# EasyEDA Pro project ESP32-C3-Devkit-M1自动灌溉拓展板.eprj

# Schematic Schematic1
Create Date: 2025-03-11; Page Name: P1; Project Name: ESP32WROOM浇花; Schematic Name: Schematic1; Update Date: 2025-03-11; Company: 嘉立创EDA; Page Size: A4; Version: V1.0
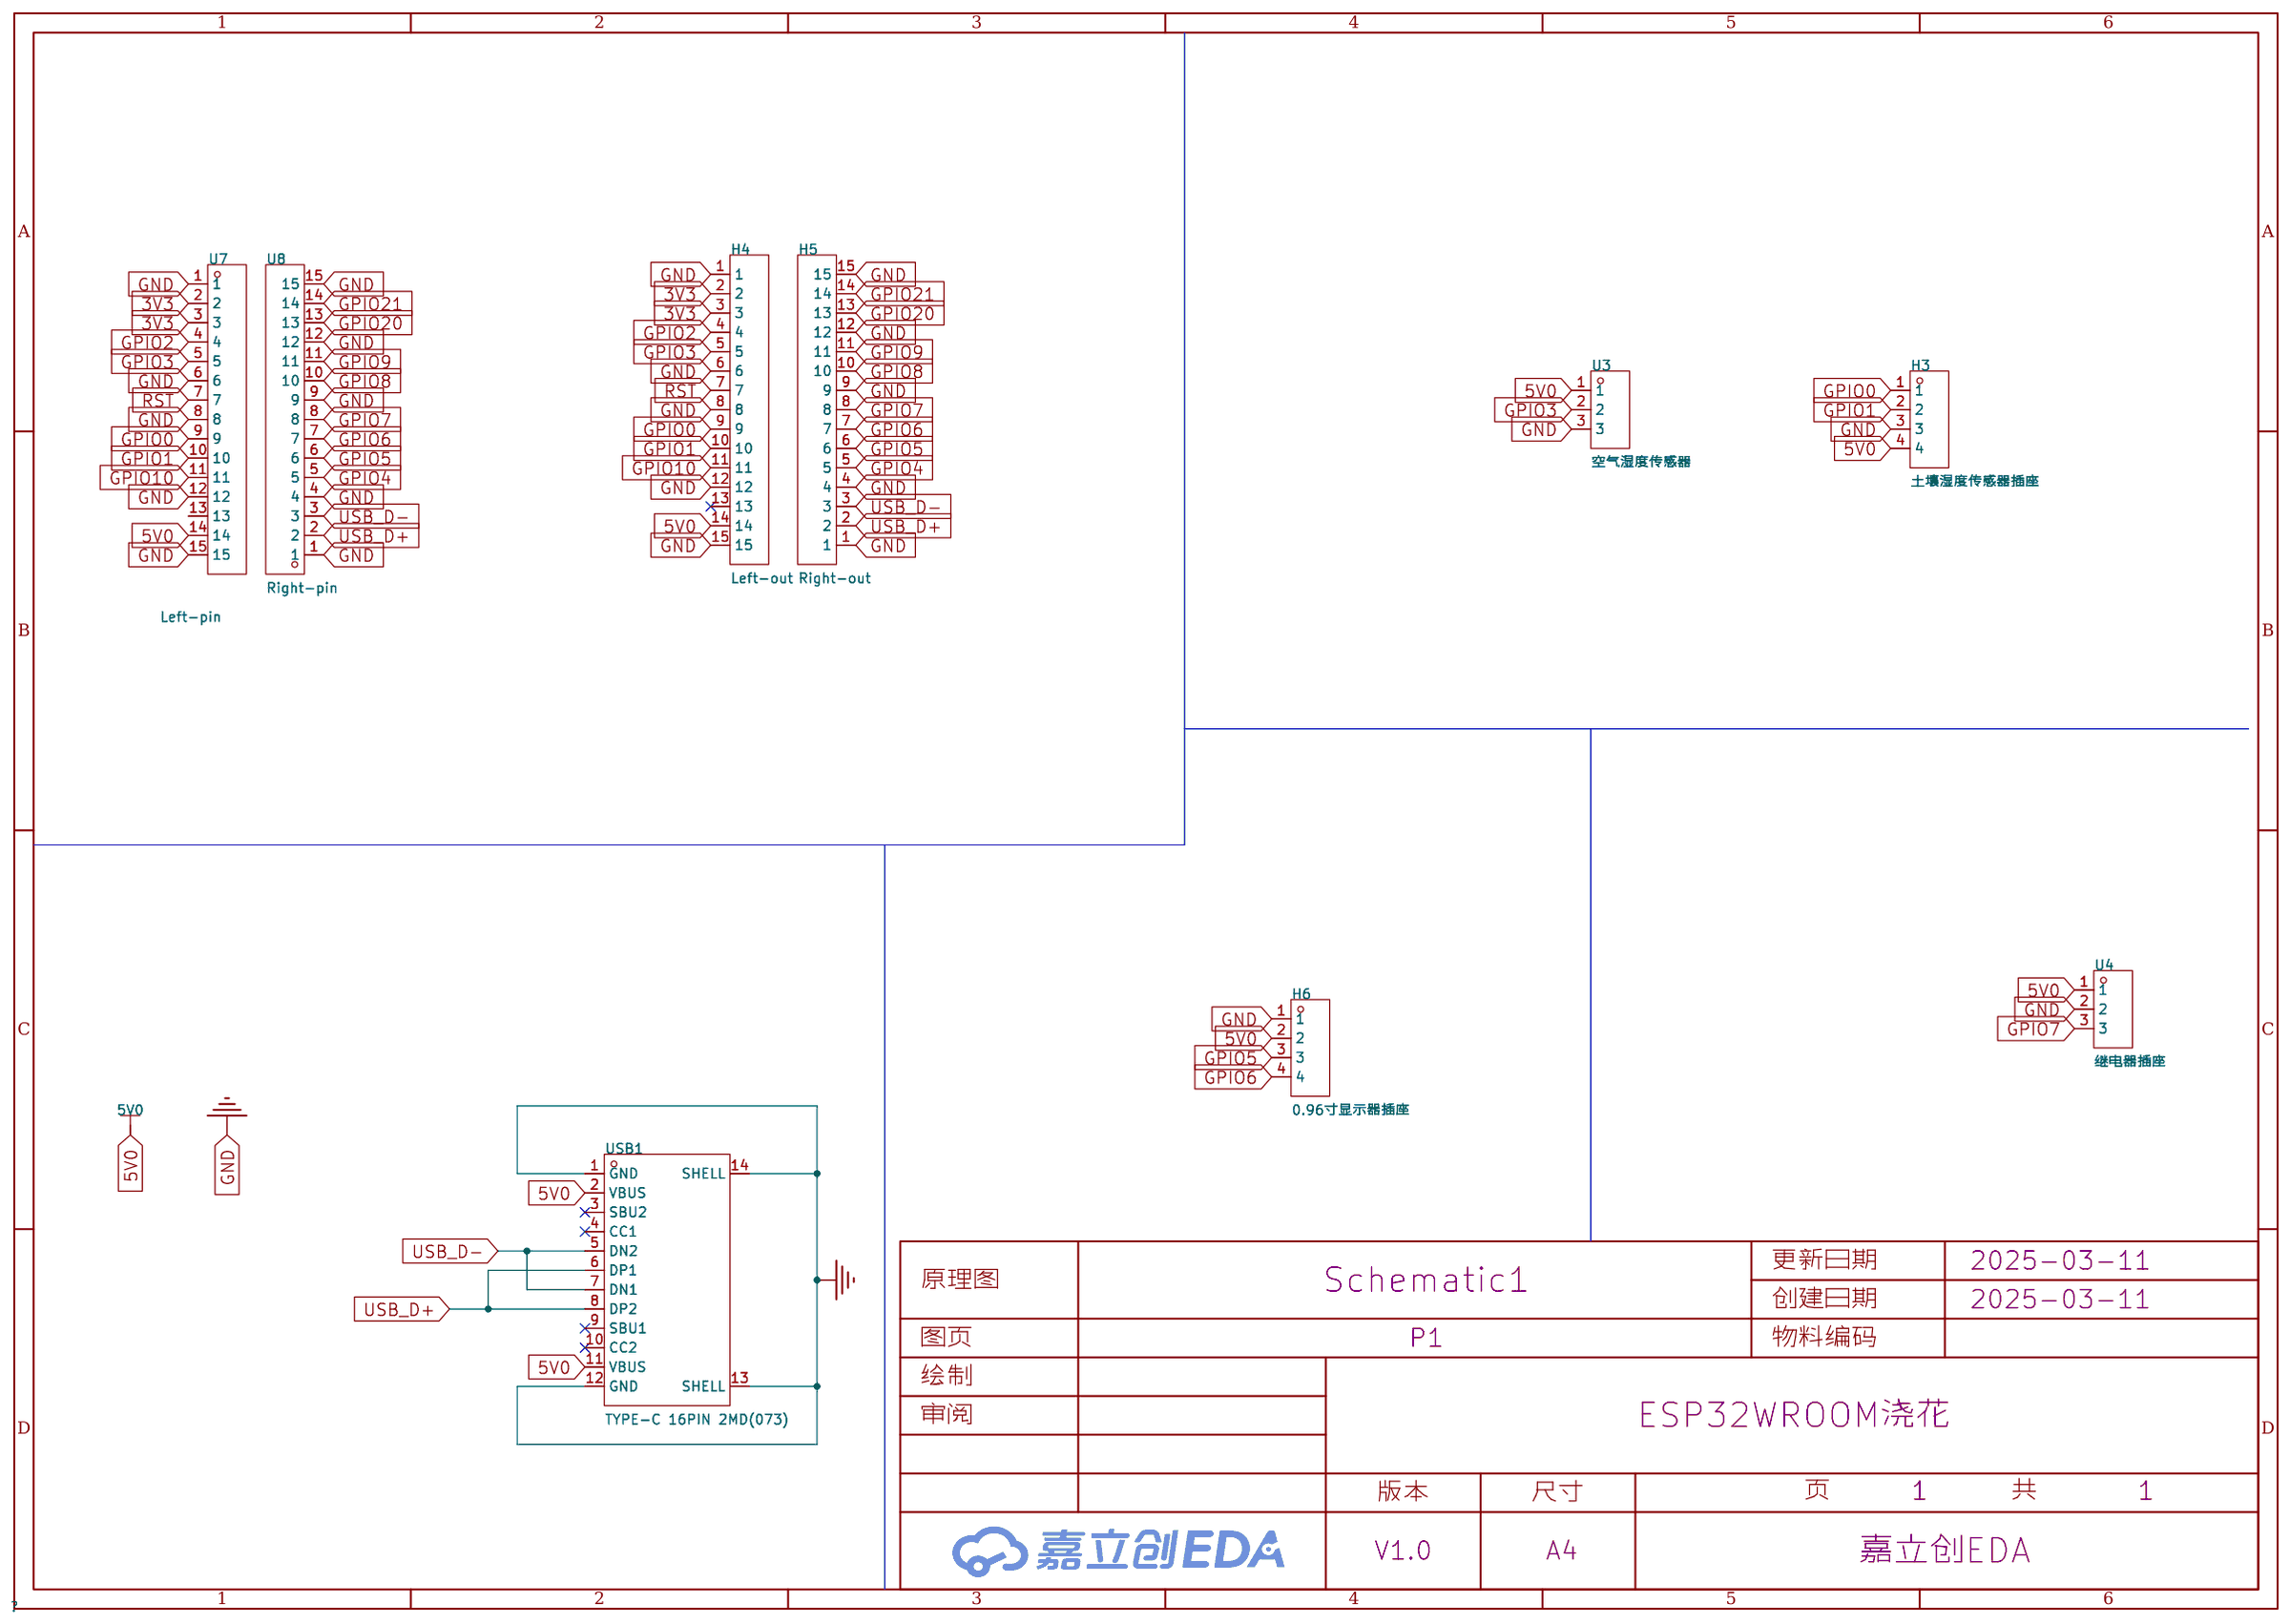
[diagram p0: schematic sheet]

## Parts
H3  土壤湿度传感器插座  [HDR-TH_4P-P2.54-V-F]
H4  Left-out  [HDR-TH_15P-P2.54-V-M]
H5  Right-out  [HDR-TH_15P-P2.54-V-M]
H6  0.96寸显示器插座  [HDR-TH_4P-P2.54-V-F]
U3  空气湿度传感器  [HDR-TH_3P-P2.54_CS-1165SDIG]
U4  继电器插座  [HDR-TH_3P-P2.54_CS-1165SDIG]
U7  Left-pin  [HDR-TH_15P-P2.54-V-F]
U8  Right-pin  [HDR-TH_15P-P2.54-V-F]
USB1  TYPE-C 16PIN 2MD(073)  [USB-C-SMD_TYPE-C-6PIN-2MD-073]

## Library data of the parts
H3 H6 = 2.54-1*4P母: 插孔结构:1x4P;间距:2.54mm;行距:-;圆孔/方孔:方孔;安装类型:直插;排数:单排;总孔位数:4P;额定电流:3A;额定电压:-;插孔方向:顶部;塑高:-;触头材质:青铜;触头镀层:-;工作温度范围:-40℃~+105℃;焊接温度(最大值):-;; LCSC Part Name: 间距:2.54mm 1x4P 直插; Supplier Part: C2718488; Manufacturer: BOOMELE(博穆精密); Supplier Footprint: 插件,P=2.54mm; JLCPCB Part Class: 扩展库; Datasheet: https://atta.szlcsc.com/upload/public/pdf/source/20210301/C2718488_F4427B881E42CAA8DDB0B1C12B3A522C.pdf; Supplier: LCSC; Holes Structure: 1x4P; Pitch: 2.54mm; Circular Hole / Square Hole: 方孔; Mounting Type: 直插; Number of Rows: 单排; Number of Holes: 4P; Current Rating (Max): 3A; Holes Direction: 顶部; Contact Material: 青铜; Operating Temperature Range: -40℃~+105℃
H4 H5 = KH-2.54PH180-1X15P-L11.5: 插针结构:1x15P;间距:2.54mm;行距:-;圆针/方针:方针;安装方式:直插;排数:单排;总PIN位数:15P;额定电流:3A;额定电压:-;配合针长度:6mm;塑高:2.5mm;端接针长度:3mm;工作温度:-40℃~+105℃;颜色:黑色;; LCSC Part Name: 1x15P 间距:2.54mm 方针 直插; Supplier Part: C2932704; Manufacturer: kinghelm(金航标); Supplier Footprint: 插件,P=2.54mm; JLCPCB Part Class: 扩展库; Datasheet: https://atta.szlcsc.com/upload/public/pdf/source/20211220/9B4C897403A4421D34166806733D6939.pdf; Supplier: LCSC; Pin Structure: 1x15P; Pitch: 2.54mm; Circluar Pins/Square Pins: 方针; Mounting Type: 直插; Number of Rows: 单排; Number of Pins: 15P; Current Rating: 3A; Length of Mating Pin: 6mm; Insulation Height: 2.5mm; Length of End Connection Pin: 3mm; Operating Temperature: -40℃~+105℃; Color: 黑色
U3 U4 = 排母2.54mm 1X3pin: Supplier Part: C9900016709; JLCPCB Part Class: 扩展库; Supplier: LCSC
U7 U8 = HC-PM254-8.5H-1x15PZ: 插孔结构:1x15P;间距:2.54mm;行距:-;圆孔/方孔:方孔;安装方式:直插;排数:单排;总孔位数:15P;额定电流:3A;额定电压:-;插孔方向:顶部;塑高:8.5mm;触头材质:黄铜;触头镀层:金;工作温度:-40℃~+105℃;; LCSC Part Name: 间距2.54mm 1x15Pin 直插 PC3.0 H8.5; Supplier Part: C22373901; Manufacturer: HC(虹成电子); Supplier Footprint: 插件,P=2.54mm; JLCPCB Part Class: 扩展库; Datasheet: https://atta.szlcsc.com/upload/public/pdf/source/20250106/1B10882395D788629D8A92AB5AFC578F.pdf; Supplier: LCSC; Holes Structure: 1x15P; Pitch: 2.54mm; Circular Hole / Square Hole: 方孔; Mounting Type: 直插; Number of Rows: 单排; Number of Positions: 15P; Current Rating: 3A; Holes Direction: 顶部; Insulation Height: 8.5mm; Contact Material: 黄铜; Contact Plating: 金; Operating Temperature: -40℃~+105℃; PIN Length: 3mm
USB1 = TYPE-C 16PIN 2MD(073): 连接器类型:Type-C;标准:USB 3.1;公母:母;安装方式:卧贴;触点数量:16P;端口数量:1;额定电流 - 电源:5A;工作温度范围:-25℃~+85℃;; LCSC Part Name: Type-C 母 卧贴; Supplier Part: C2765186; Manufacturer: SHOU HAN(首韩); Supplier Footprint: SMD; JLCPCB Part Class: 扩展库; Datasheet: https://atta.szlcsc.com/upload/public/pdf/source/20211123/39B17C16241EAC15C5E277BDA434118E.pdf; Supplier: LCSC; Connector Type: Type-C; Standard: USB 3.1; Gender: 母; Mounting Style: 卧贴; Number of Contacts: 16P; Number of Ports: 1; Current Rating - Power (Max): 5A; Operating Temperature Range: -25℃~+85℃; Rated Voltage (Max): 5V; Connect-Disconnect Life: 5千次; Core Colour: 黑色

## Nets
3V3: H4.2 H4.3 U7.2 U7.3
5V0: H3.4 H4.14 H6.2 U3.1 U4.1 U7.14 USB1.2(VBUS) USB1.11(VBUS)
GND: H3.3 H4.1 H4.6 H4.8 H4.12 H4.15 H5.1 H5.4 H5.9 H5.12 H5.15 H6.1 U3.3 U4.2 U7.1 U7.6 U7.8 U7.12 U7.15 U8.1 U8.4 U8.9 U8.12 U8.15 USB1.1(GND) USB1.12(GND) USB1.13(SHELL) USB1.14(SHELL)
GPIO0: H3.1 H4.9 U7.9
GPIO1: H3.2 H4.10 U7.10
GPIO2: H4.4 U7.4
GPIO3: H4.5 U3.2 U7.5
GPIO4: H5.5 U8.5
GPIO5: H5.6 H6.3 U8.6
GPIO6: H5.7 H6.4 U8.7
GPIO7: H5.8 U4.3 U8.8
GPIO8: H5.10 U8.10
GPIO9: H5.11 U8.11
GPIO10: H4.11 U7.11
GPIO20: H5.13 U8.13
GPIO21: H5.14 U8.14
RST: H4.7 U7.7
USB_D+: H5.2 U8.2 USB1.6(DP1) USB1.8(DP2)
USB_D-: H5.3 U8.3 USB1.5(DN2) USB1.7(DN1)

Not connected (* = marked no-connect by the designer): H4 13*; U7 13; USB1 3(SBU2)* 4(CC1)* 9(SBU1)* 10(CC2)*

# Board PCB1
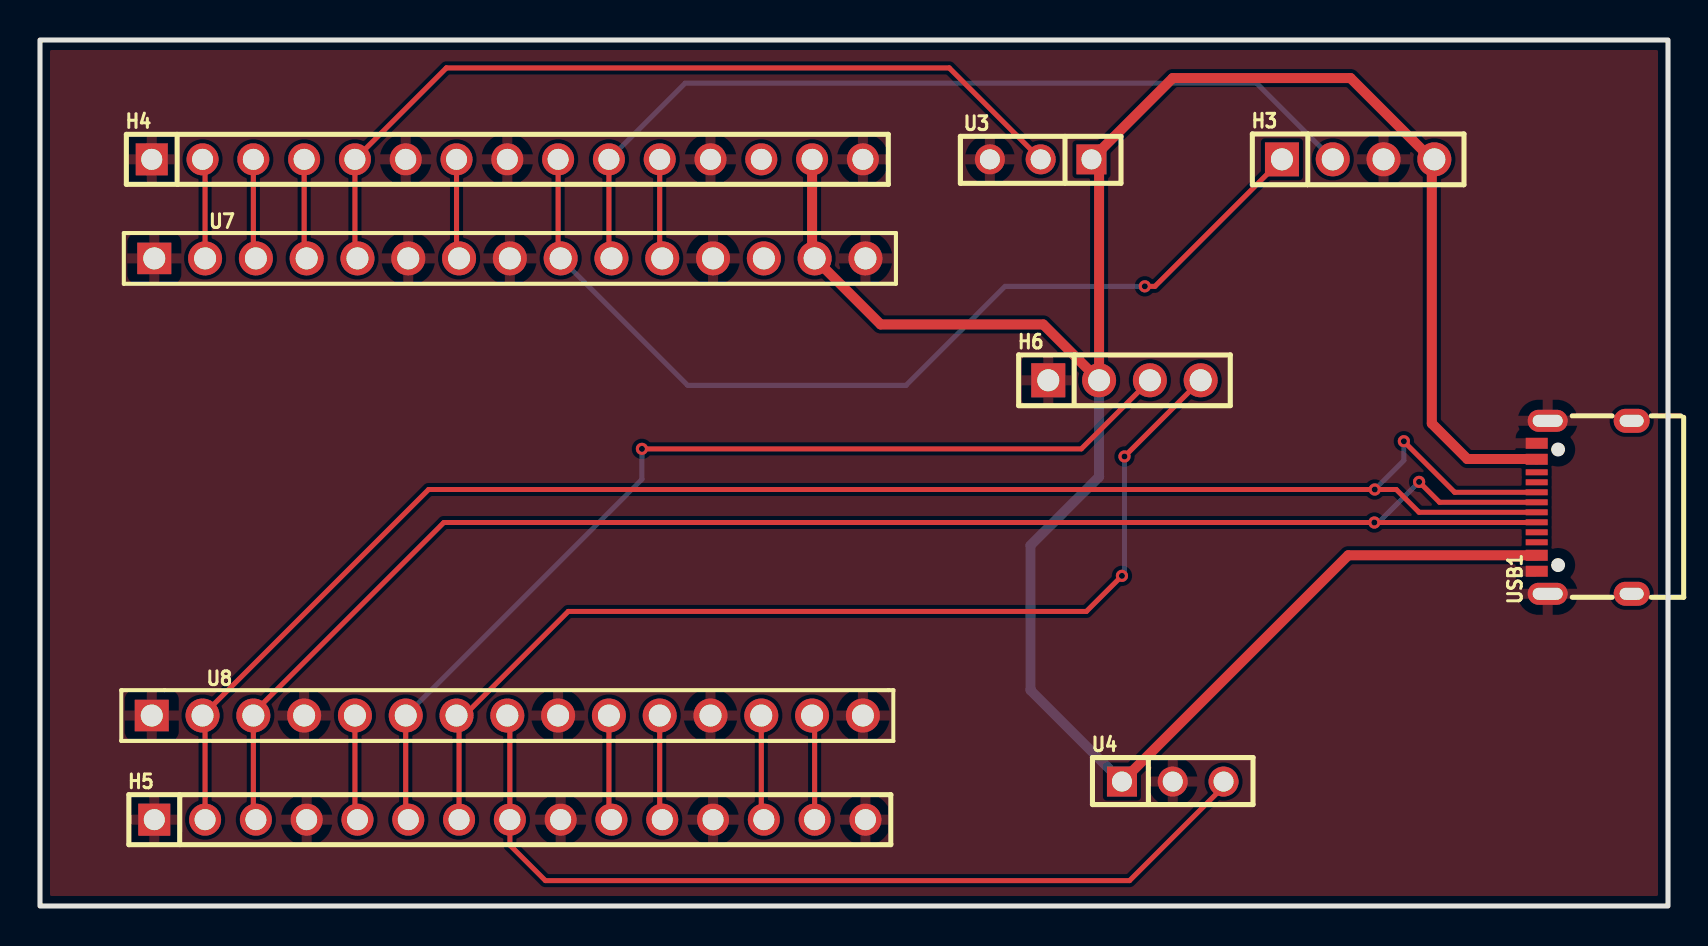
[diagram p1: board, top side]
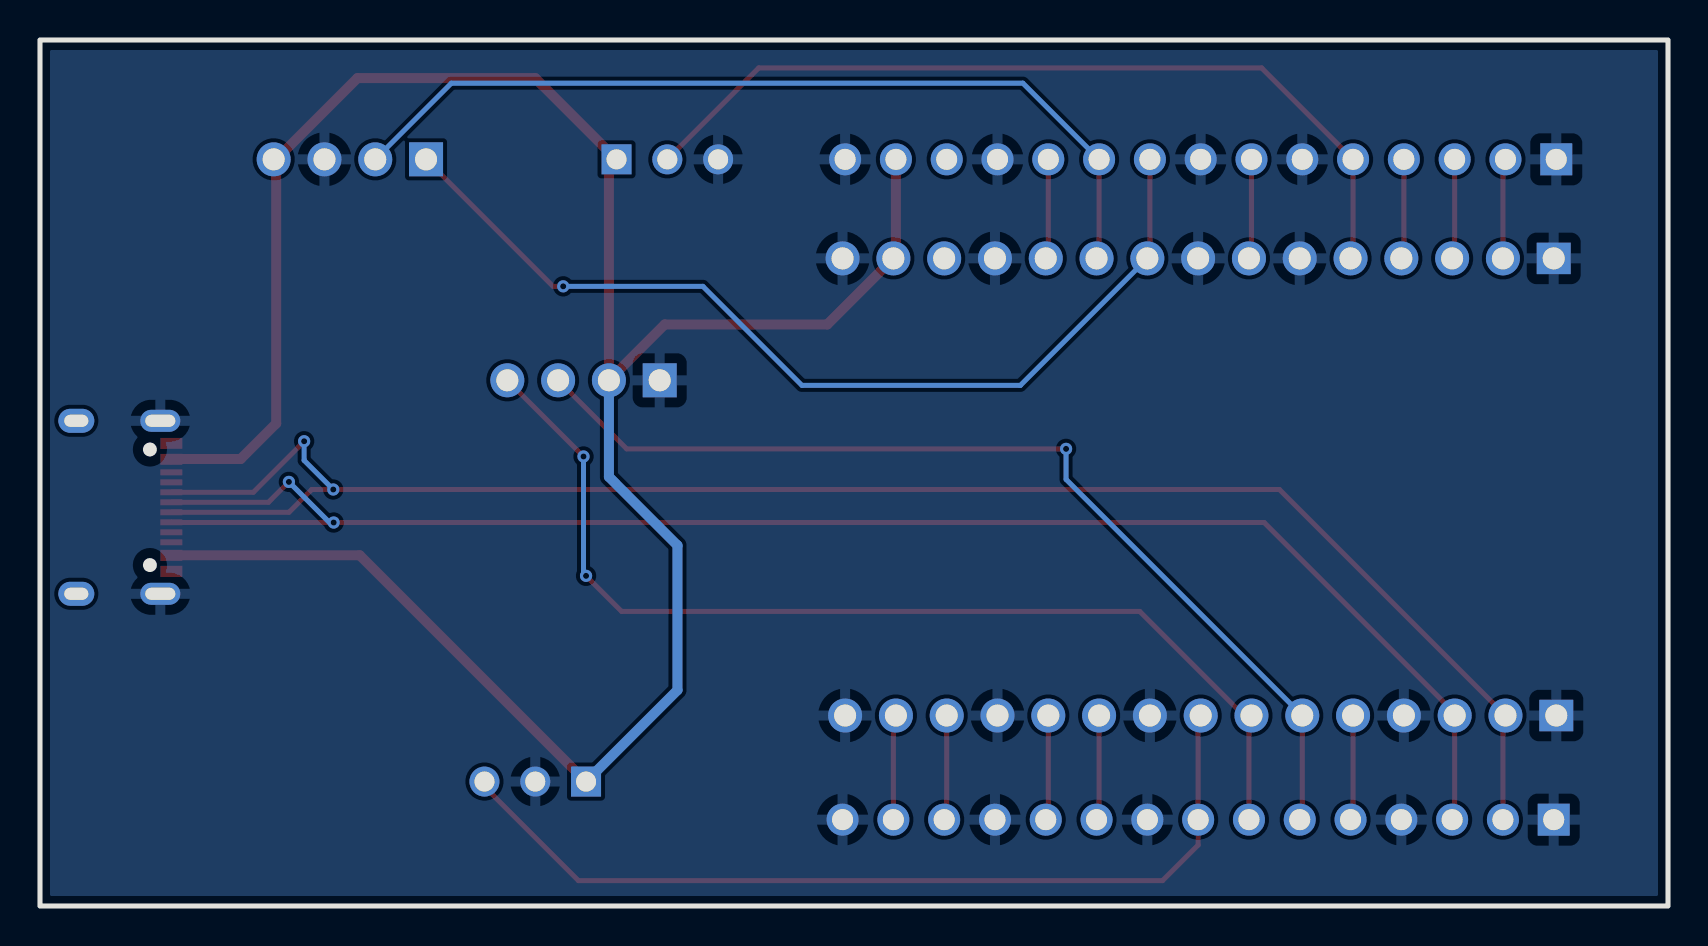
[diagram p2: board, bottom side, seen from below]

Outline 81.41 x 43.31 mm; copper layers: Top Layer, Bottom Layer. Coordinates in mm from the lower left corner of the outline.
Outline path: rectangle 0,43.31 81.41,0
Stack: Top Layer 0.035mm / Dielectric1 1.51mm FR4 er 4.5 / Bottom Layer 0.035mm

## Design rules (mm)
template: JLCPCB Capability(Two Layers Board)
spacing copperThickness1oz (default): track to track 0.102, other pairs 0.152 to 0.3
spacing copperThickness2oz: track to track 0.203, other pairs 0.152 to 0.3
track width copperThickness1oz (default): min 0.127, default 0.254, max 2.54
track width copperThickness2oz: min 0.203, default 0.254, max 2.54
differential pair differentialPair (default): width min 0.127, default 0.254, max 2.54; gap min 0.152, default 0.152
via viaSize (default): diameter min 0.5, default 0.61, max 10; hole min 0.3, default 0.305, max 6.3

## Placement (name value [footprint] x y rotation side)
H3  土壤湿度传感器插座  [HDR-TH_4P-P2.54-V-F]  65.91 37.34 0 top
H4  Left-out  [HDR-TH_15P-P2.54-V-M]  23.37 37.34 0 top
H5  Right-out  [HDR-TH_15P-P2.54-V-M]  23.49 4.32 0 top
H6  0.96寸显示器插座  [HDR-TH_4P-P2.54-V-F]  54.23 26.29 0 top
U3  空气湿度传感器  [HDR-TH_3P-P2.54_CS-1165SDIG]  50.04 37.34 180 top
U4  继电器插座  [HDR-TH_3P-P2.54_CS-1165SDIG]  56.64 6.22 0 top
U7  Left-pin  [HDR-TH_15P-P2.54-V-F]  23.49 32.39 0 top
U8  Right-pin  [HDR-TH_15P-P2.54-V-F]  23.37 9.53 0 top
USB1  TYPE-C 16PIN 2MD(073)  [USB-C-SMD_TYPE-C-6PIN-2MD-073]  77.22 19.94 90 top

## Footprints (pads in the part's own frame, mm; a bottom-side part is the same pattern mirrored in y, then rotated)
HDR-TH_3P-P2.54_CS-1165SDIG
  rect 1.5x1.5 hole 1: 1(-2.54,0)
  round 1.5 hole 1: 2(0,0) 3(2.54,0)
HDR-TH_4P-P2.54-V-F
  rect 1.7x1.7 hole 1.1: 1(-3.81,0)
  round 1.7 hole 1.1: 2(-1.27,0) 3(1.27,0) 4(3.81,0)
HDR-TH_15P-P2.54-V-F
  rect 1.7x1.575 hole 1.1: 1(-17.78,0)
  round 1.7 hole 1.1: 2(-15.24,0) 3(-12.7,0) 4(-10.16,0) 5(-7.62,0) 6(-5.08,0) 7(-2.54,0) 8(0,0) 9(2.54,0) 10(5.08,0) 11(7.62,0) 12(10.16,0) 13(12.7,0) 14(15.24,0) 15(17.78,0)
HDR-TH_15P-P2.54-V-M
  rect 1.6x1.6 hole 1.05: 1(-17.78,0)
  round 1.6 hole 1.05: 2(-15.24,0) 3(-12.7,0) 4(-10.16,0) 5(-7.62,0) 6(-5.08,0) 7(-2.54,0) 8(0,0) 9(2.54,0) 10(5.08,0) 11(7.62,0) 12(10.16,0) 13(12.7,0) 14(15.24,0) 15(17.78,0)
USB-C-SMD_TYPE-C-6PIN-2MD-073
  rect 0.55x1.1 smd: 1(-3.2,2.375) 2(-2.4,2.375) 11(2.4,2.375) 12(3.2,2.375)
  rect 0.3x1.1 smd: 3(-1.75,2.375) 4(-1.25,2.375) 5(-0.75,2.375) 6(-0.25,2.375) 7(0.25,2.375) 8(0.75,2.375) 9(1.25,2.375) 10(1.75,2.375)
  oval 1.1x2 hole 0.6x1.5: 13(-4.325,1.825) 14(4.325,1.825)
  oval 1.2x1.8 hole 0.6x1.2: 13(-4.325,-2.375) 14(4.325,-2.375)

## Nets
As in the schematic.

Pads without a net: H4 13; U7 13; USB1 3 4 9 10

## Via types
v1: diameter 0.61, hole 0.305, Top Layer to Bottom Layer, 8 vias

## Routing (per net, layer and track width the routed paths; a pad name or vN(x,y) marks a point on that pad's centre or on a via; arc(x,y) is an arc through that point)
3V3: length 10
  Top Layer w0.254: U7.3 10.67,32.51 H4.3 ; U7.2 8.25,37.21 H4.2
5V0: length 121.3
  Top Layer w0.254: U3.1 52.96,36.96
  Top Layer w0.5: U4.1 65.42,17.54 USB1.2 ; 52.96,36.96 H6.2 50.17,29.08 42.04,29.08 U7.14 38.61,32.51 H4.14 ; U3.1 56.64,41.4 65.53,41.4 69.6,37.34 69.6,24.13 71.37,22.35 74.83,22.35 USB1.11
  Bottom Layer w0.5: U4.1 49.53,10.8 49.53,18.03 52.96,21.46 H6.2
GPIO0: length 48.3
  Top Layer w0.25: 55.37,30.99 55.75,30.99 H3.1
  Top Layer w0.254: U7.9 25.91,32.51 H4.9
  Bottom Layer w0.25: U7.9 32.39,26.03 43.31,26.03 48.26,30.99 v1(55.24,30.99)
GPIO1: length 44.4
  Top Layer w0.254: H4.10 28.45,32.51 U7.10
  Bottom Layer w0.25: H3.2 60.83,41.15 32.26,41.15 H4.10
GPIO2: length 5
  Top Layer w0.254: U7.4 13.21,32.51 H4.4
GPIO3: length 43.1
  Top Layer w0.254: U7.5 15.75,32.51 H4.5 20.32,41.91 45.47,41.91 U3.2
GPIO4: length 5.3
  Top Layer w0.254: H5.5 15.75,4.45 U8.5
GPIO5: length 50.3
  Top Layer w0.25: v1(30.1,22.86) 52.07,22.86 H6.3
  Top Layer w0.254: U8.6 18.29,4.45 H5.6
  Bottom Layer w0.25: U8.6 30.1,21.34 v1(30.1,22.86)
GPIO6: length 52.8
  Top Layer w0.25: v1(54.1,16.51) 52.32,14.73 26.42,14.73 21.21,9.53 U8.7 ; H6.4 v1(54.23,22.48)
  Top Layer w0.254: H5.7 20.95,9.4 U8.7
  Bottom Layer w0.25: v1(54.23,22.48) 54.23,16.64 v1(54.1,16.51)
GPIO7: length 45.2
  Top Layer w0.25: U4.3 59.18,5.97 54.48,1.27 25.27,1.27 23.49,3.05 H5.8
  Top Layer w0.254: H5.8 23.49,9.4 U8.8
GPIO8: length 5.3
  Top Layer w0.254: H5.10 28.45,4.45 U8.10
GPIO9: length 5.3
  Top Layer w0.254: U8.11 30.99,4.45 H5.11
GPIO10: length 5
  Top Layer w0.254: H4.11 30.99,32.51 U7.11
GPIO20: length 5.3
  Top Layer w0.254: U8.13 36.07,4.45 H5.13
GPIO21: length 5.3
  Top Layer w0.254: H5.14 38.73,9.4 U8.14
RST: length 5
  Top Layer w0.254: U7.7 20.83,32.51 H4.7
USB_D+: length 87.8
  Top Layer w0.25: USB1.8 70.74,20.69 68.2,23.23 v1(68.2,23.24) ; USB1.6 68.96,19.69 67.82,20.83 v1(66.74,20.83) 19.43,20.83 U8.2
  Top Layer w0.254: H5.2 8.25,9.4 U8.2
  Bottom Layer w0.25: v1(66.74,20.83) 68.2,22.28 v1(68.2,23.24)
USB_D-: length 82.9
  Top Layer w0.25: USB1.5 74.83,19.18 v1(66.72,19.18) 20.19,19.18 10.67,9.65 U8.3 ; USB1.7 69.98,20.19 v1(68.96,21.21)
  Top Layer w0.254: H5.3 10.67,4.45 U8.3
  Bottom Layer w0.25: v1(66.72,19.18) 66.93,19.18 v1(68.96,21.21)

## Copper pours and planes (outline as drawn; the poured copper is in the pictures)
GND on Top Layer: 0,43.31 81.41,43.31 81.41,0 0,0
GND on Bottom Layer: 0,43.31 81.41,43.31 81.41,0 0,0
